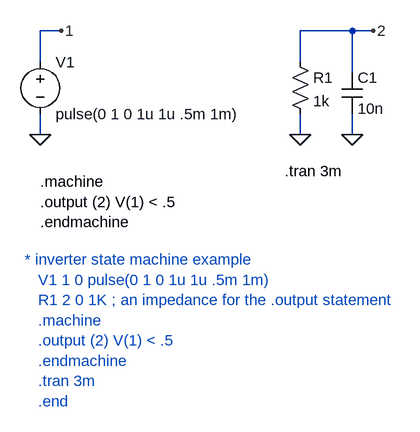
[diagram p0: schematic Fig_3-52_Ex_Machine-1.asc]
Fig_3-52_Ex_Machine-1.asc, the LTspice schematic file:
Version 4
SHEET 1 880 948
WIRE 64 368 32 368
WIRE 512 368 432 368
WIRE 544 368 512 368
WIRE 32 416 32 368
WIRE 432 416 432 368
WIRE 512 432 512 368
WIRE 32 528 32 496
WIRE 432 528 432 496
WIRE 512 528 512 496
FLAG 32 528 0
FLAG 64 368 1
FLAG 432 528 0
FLAG 544 368 2
FLAG 512 528 0
SYMBOL voltage 32 400 R0
SYMATTR InstName V1
SYMATTR Value pulse(0 1 0 1u 1u .5m 1m)
SYMBOL res 416 400 R0
SYMATTR InstName R1
SYMATTR Value 1k
SYMBOL cap 496 432 R0
SYMATTR InstName C1
SYMATTR Value 10n
TEXT 8 720 Left 2 ;* inverter state machine example \n   V1 1 0 pulse(0 1 0 1u 1u .5m 1m) \n   R1 2 0 1K ; an impedance for the .output statement \n   .machine \n   .output (2) V(1) < .5 \n   .endmachine \n   .tran 3m \n   .end
TEXT 32 600 Left 2 !.machine \n.output (2) V(1) < .5 \n.endmachine
TEXT 408 584 Left 2 !.tran 3m

The netlist it stands for:
* Fig_3-52_Ex_Machine-1.asc
V1 1 0 pulse(0 1 0 1u 1u .5m 1m)
R1 2 0 1k
C1 2 0 10n
* * inverter state machine example
*    V1 1 0 pulse(0 1 0 1u 1u .5m 1m)
*    R1 2 0 1K ; an impedance for the .output statement
*    .machine
*    .output (2) V(1) < .5
*    .endmachine
*    .tran 3m
*    .end
.machine
.output (2) V(1) < .5
.endmachine
.tran 3m
.backanno
.end